# EAGLE design nrf24l01+_reference_module (EAGLE 9.6.0)
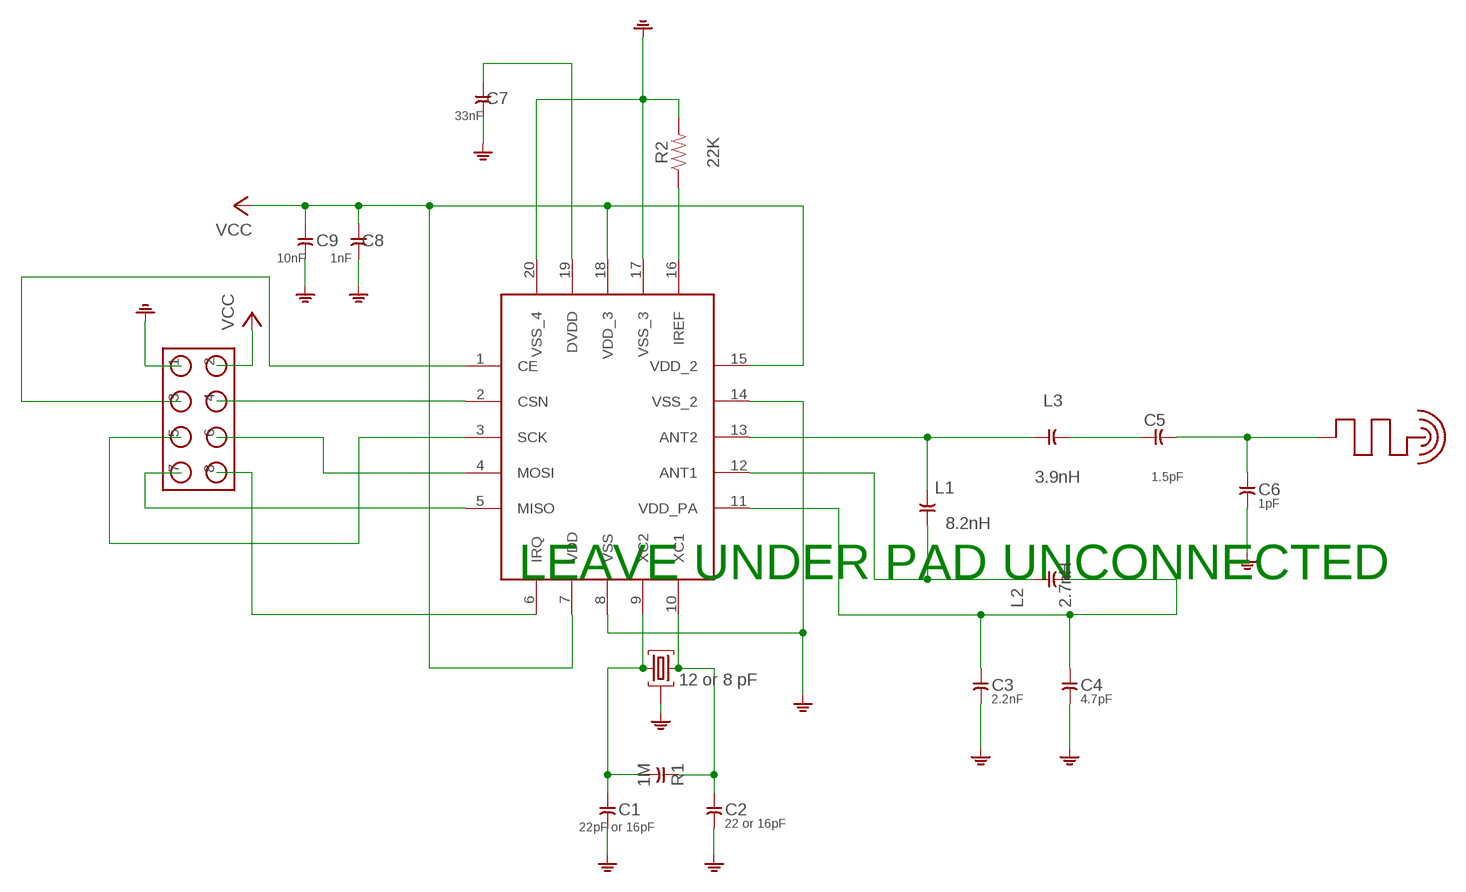
[diagram p0: schematic, sheet 1]

## Parts
C1  22pF or 16pF  CAP_0402_ULTRA_COMPACT  [0402_ULTRA_COMPACT]
C2  22 or 16pF  CAP_0402_ULTRA_COMPACT  [0402_ULTRA_COMPACT]
C3  2.2nF  CAP_0402_ULTRA_COMPACT  [0402_ULTRA_COMPACT]
C4  4.7pF  CAP_0402_ULTRA_COMPACT  [0402_ULTRA_COMPACT]
C5  1.5pF  CAP_0402_ULTRA_COMPACT  [0402_ULTRA_COMPACT]
C6  1pF  CAP_0402_ULTRA_COMPACT  [0402_ULTRA_COMPACT]
C7  33nF  CAP_0402_ULTRA_COMPACT  [0402_ULTRA_COMPACT]
C8  1nF  CAP_0402_ULTRA_COMPACT  [0402_ULTRA_COMPACT]
C9  10nF  CAP_0402_ULTRA_COMPACT  [0402_ULTRA_COMPACT]
L1  8.2nH  CAP_0402_ULTRA_COMPACT  [0402_ULTRA_COMPACT]
L2  2.7nH  CAP_0402_ULTRA_COMPACT  [0402_ULTRA_COMPACT]
L3  3.9nH  CAP_0402_ULTRA_COMPACT  [0402_ULTRA_COMPACT]
R1  1M  CAP_0402_ULTRA_COMPACT  [0402_ULTRA_COMPACT]
R2  22K  RESISTOR_0402  [0402_COMPACT]
U$1  NRF24L01+_NO_UNDERSIDE_PAD  [QFN20_4MM_NO_BOTTOM_PAD]
U$2  HEADER_2X4  [2X4_2.54MM]
U$4  12 or 8 pF  CRYSTAL_PINT_SIZE  [CRYSTAL_SMD4_PINT_SIZE]
U$5  ANTENNA_NRF_REFERENCE_MODULE  [ANTENNA_NRF_REFERENCE_MODULE]

## Nets
GND: C1.2 C2.2 C3.2 C4.2 C6.2 C7.2 C8.2 C9.2 R2.2 U$1.8(VSS) U$1.14(VSS_2) U$1.17(VSS_3) U$1.20(VSS_4) U$2.1 U$4.2(GND)(GND) U$4.4(GND)(GND)
N$1: U$1.1(CE) U$2.3
N$2: U$1.2(CSN) U$2.4
N$3: U$1.3(SCK) U$2.5
N$4: U$1.4(MOSI) U$2.6
N$5: U$1.5(MISO) U$2.7
N$6: U$1.6(IRQ) U$2.8
N$7: C1.1 R1.2 U$1.9(XC2) U$4.1
N$8: C2.1 R1.1 U$1.10(XC1) U$4.3
N$9: C7.1 U$1.19(DVDD)
N$10: L1.2 L3.1 U$1.13(ANT2)
N$11: R2.1 U$1.16(IREF)
N$12: L1.1 L2.1 U$1.12(ANT1)
N$13: C3.1 C4.1 L2.2 U$1.11(VDD_PA)
N$14: C5.1 L3.2
N$15: C5.2 C6.1 U$5.P$1
VCC: C8.1 C9.1 U$1.7(VDD) U$1.15(VDD_2) U$1.18(VDD_3) U$2.2

## Notes on the sheet
- LEAVE UNDER PAD UNCONNECTED

## Library data of the parts
C1-C9 L1-L3 R1 = RonanLibrary:CAP_0402
R2 = RonanLibrary:RESISTOR_0402
U$1 = RonanLibrary:NRF24L01+
U$2 = RonanLibrary:HEADER_2X4
U$4 = RonanLibrary:CRYSTAL
U$5 = RonanLibrary:ANTENNA_NRF_REFERENCE_MODULE

## Board
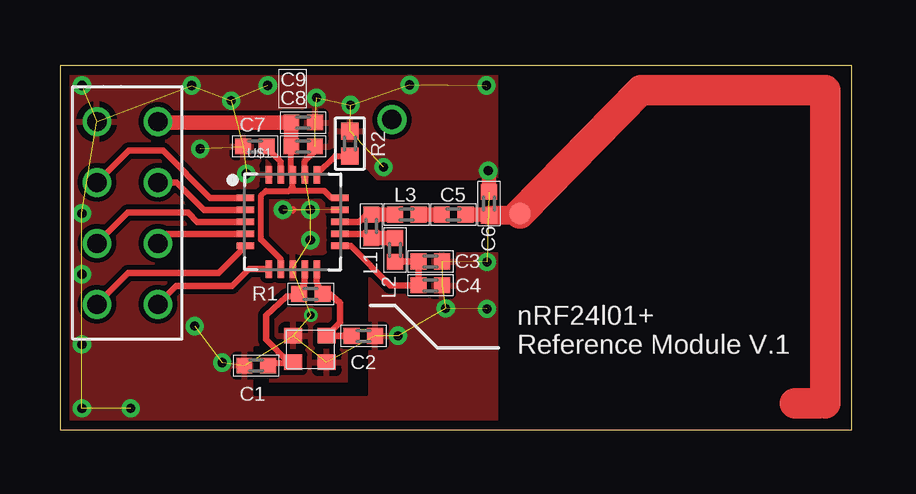
[diagram p1: board, top side]
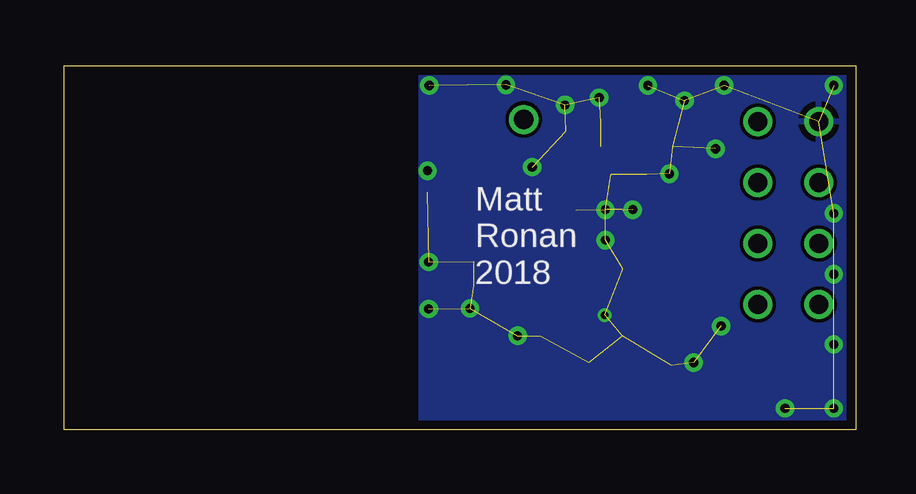
[diagram p2: board, bottom side, seen from below]

Size 33 x 15.2 mm. Coordinates in mm from the lower left corner, seen from the top.
Outline: 0,0 33,0 33,15.2 0,15.2 0,0
Copper layers (1*16): Top 0.035559375mm / dielectric 1.6mm / Bottom 0.035559375mm
Design rules "oshpark-2layer *": minimum track width 6mil, minimum drill 10mil, track to track 6mil, track to pad 6mil, pad to pad 6mil, via to via 6mil, smd to smd 6mil, copper to edge 15mil, drill to drill 6mil, minimum pad ring 5mil, minimum via ring 5mil, stop-mask expansion 2.5mil, vias tented up to drill 15mil, thermal gap 10mil

### Footprints (pad centres in the part's own frame; a part is rotated, then mirrored left to right if it is on the bottom)
0402_ULTRA_COMPACT = smd 0.66 x 0.66: 1 -0.491,0; 2 0.491,0
0402_COMPACT = smd 0.711 x 0.711: 1 -0.516,0; 2 0.516,0
QFN20_4MM_NO_BOTTOM_PAD = smd 0.73 x 0.28: 1 -1.965,1; 2 -1.965,0.5; 3 -1.965,0; 4 -1.965,-0.5; 5 -1.965,-1; 11 1.965,-1; 12 1.965,-0.5; 13 1.965,0; 14 1.965,0.5; 15 1.965,1 | smd 0.28 x 0.73: 6 -1,-1.965; 7 -0.5,-1.965; 8 0,-1.965; 9 0.5,-1.965; 10 1,-1.965; 16 1,1.965; 17 0.5,1.965; 18 0,1.965; 19 -0.5,1.965; 20 -1,1.965
2X4_2.54MM = drill 0.8: 1 -3.81,-1.27; 2 -3.81,1.27; 3 -1.27,-1.27; 4 -1.27,1.27; 5 1.27,-1.27; 6 1.27,1.27; 7 3.81,-1.27; 8 3.81,1.27
CRYSTAL_SMD4_PINT_SIZE = smd 0.75 x 0.65: 1 -0.7,-0.55; 2(GND) 0.7,-0.55; 3 0.7,0.55; 4(GND) -0.7,0.55
ANTENNA_NRF_REFERENCE_MODULE = smd 0.889 x 0.889: P$1 -13.36,8.56

### Placement (x,y rotation side)
C1  8.18,2.68 180 top
C2  12.65,3.93 0 top
C3  15.44,7.02 0 top
C4  15.44,6.03 0 top
C5  16.41,8.98 0 top
C6  17.88,9.44 90 top
C7  8.13,11.83 180 top
C8  10.13,11.83 0 top
C9  10.14,12.82 0 top
L1  12.98,8.5 90 top
L2  13.97,7.51 270 top
L3  14.45,8.98 0 top
R1  10.46,5.67 180 top
R2  12.08,11.94 90 top
U$1  9.7,8.68 0 top
U$2  2.81,9.05 270 top
U$4  10.42,3.37 0 top
U$5  32.54,0.47 0 top

### Tracks (layer width: path | path; a pad name or v marks a point on that pad's centre or on a via)
GND  (via drill 0.3, 0.38 pad 0.76)  (41 unrouted)
  Top 0.254: U$1.17 10.2,11.18 10.63,11.61 C8.2
  Top 0.279: 9.73,9.18 9.7,9.16
  Top 0.61: C6.2 17.88,10.81 v17.86,10.81
  other vias: 10.46,4.79 17.78,14.37 13.49,10.96 14.58,14.39 12.12,13.55 10.69,13.86 8.66,14.37 7.14,13.73 5.49,14.37 0.91,14.37 0.91,9.03 0.91,6.49 0.91,3.57 0.91,0.9 2.95,0.9 5.61,4.33 17.81,7 17.81,5.04 16.08,5.07 14.1,3.93 6.76,2.81 10.44,9.18 9.3,9.18 10.44,7.91 7.77,10.68 5.84,11.72
  pour Top (isolate 0.203): -1,16.1 18.2,16.1 18.2,-0.9 -1,-0.9
  cutout Top: 19,10.4 19,7.43 13,7.43 13,10.4
  cutout Top: 8.13,1.49 8.13,3.42 8.64,3.42 8.64,1.89 12.06,1.89 12.06,6.72 12.78,6.72 12.78,1.49
  pour Bottom: -1.02,16.12 -1.02,-0.9 18.16,-0.9 18.16,16.12
  cutout Top: 10.26,12.56 10.77,12.56 10.77,11.16 10.26,11.16
  cutout Top: 12.57,11.04 13.21,10.4 13.21,10.28 13.21,9.77 12.32,8.88 12.06,8.88 11.94,8.75 11.94,10.91 12.45,10.91
  cutout Top: 10.9,7.2 11.33,7.48 12.22,7.41 12.7,6.57 11.46,6.03 10.67,6.19
  cutout Top: 15.62,6.72 16.26,6.72 16.26,6.21 15.62,6.21
N$1
  Top 0.279: U$2.3 2.87,11.65 4.29,11.65 6.26,9.68 U$1.1
N$2
  Top 0.279: U$2.4 4.86,10.32 6,9.18 U$1.2
N$3
  Top 0.279: U$2.5 2.82,9.06 5.33,9.06 5.71,8.68 U$1.3
N$4
  Top 0.279: U$2.6 4.48,8.18 U$1.4
N$5
  Top 0.279: U$2.7 2.84,6.54 6.6,6.54 U$1.5
N$6
  Top 0.279: U$2.8 4.84,6 7.18,6 7.89,6.71 U$1.6
N$7
  Top 0.254: U$4.1 9.67,2.77 8.76,2.77 C1.1
  Top 0.279: U$1.9 10.2,6.14 R1.2 9.84,5.57 9.45,5.57 8.59,4.76 8.59,3.77 9.54,2.82 U$4.1
N$8
  Top 0.279: U$1.10 10.7,6.15 R1.1 11.24,5.67 11.68,5.3 11.68,4.48 U$4.3 C2.1
N$9
  Top 0.279: U$1.19 9.2,11.18 8.62,11.77 C7.1
N$10
  Top 0.279: U$1.13 12.46,8.68 12.78,8.99 L1.2
  Top 0.61: L1.2 L3.1
N$11
  Top 0.254: U$1.16 11.48,11.42 R2.1
N$12
  Top 0.279: U$1.12 12.81,8.18 L1.1
  Top 0.61: L1.1 L2.1
N$13
  Top 0.279: L2.2 C3.1 C4.1 13.77,6.03 12.12,7.68 U$1.11
N$14
  Top 0.61: L3.2 C5.1
N$15
  Top 0.61: C5.2 17.87,8.98 C6.1
  Top 0.796: U$5.P$1 19.1,8.95 C6.1
N$16  (via drill 0.81)
  other vias: 13.84,12.94
VCC
  Top 0.254: C8.1 9.64,10.7 U$1.18 9.7,10.12 9.55,9.97 | U$1.7 9.2,7.12 8.38,7.94 8.38,9.77 8.59,9.97 9.55,9.97 | U$1.15 11.32,9.68 11.02,9.97 9.55,9.97
  Top 0.61: C9.1 | C9.1 C8.1 | U$2.2 4.12,12.82 C9.1

### Text on the board
tNames: nRF24l01+ / Reference Module V.1
bNames: Matt / Ronan / 2018